# EAGLE schematic PB (EAGLE 9.1.3)
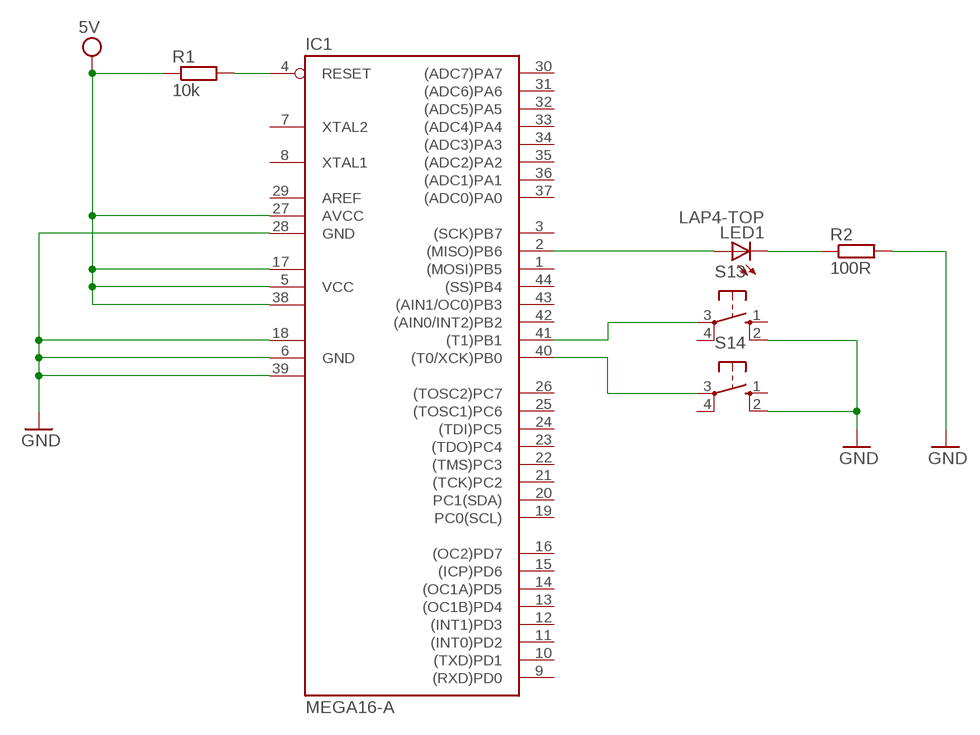
[diagram p0: schematic, sheet 1]

## Parts
IC1  MEGA16-A  [TQFP44]
LED1  LAP4-TOP  [P47F-TOP]
R1  10k  R-EU_M0805  [M0805]
R2  100R  R-EU_M0805  [M0805]
S13  40/XX  [B3F/40XX]
S14  40/XX  [B3F/40XX]

## Nets
GND: IC1.6(GND) IC1.18(GND1) IC1.28(GND) IC1.39(GND2) R2.2 S13.2(S1) S14.2(S1)
N$1: IC1.4(RESET) R1.2
N$5: IC1.41((T1)PB1) S13.3(P)
N$6: IC1.40((T0/XCK)PB0) S14.3(P)
N$7: IC1.2((MISO)PB6) LED1.A
N$8: LED1.C R2.1
VCC: IC1.5(VCC) IC1.17(VCC1) IC1.27(AVCC) IC1.38(VCC2) R1.1 ; supply symbol labelled 5V
Unconnected: IC1.1((MOSI)PB5) IC1.3((SCK)PB7) IC1.7(XTAL2) IC1.8(XTAL1) IC1.9((RXD)PD0) IC1.10((TXD)PD1) IC1.11((INT0)PD2) IC1.12((INT1)PD3) IC1.13((OC1B)PD4) IC1.14((OC1A)PD5) IC1.15((ICP)PD6) IC1.16((OC2)PD7) IC1.19(PC0(SCL)) IC1.20(PC1(SDA)) IC1.21((TCK)PC2) IC1.22((TMS)PC3) IC1.23((TDO)PC4) IC1.24((TDI)PC5) IC1.25((TOSC1)PC6) IC1.26((TOSC2)PC7) IC1.29(AREF) IC1.30((ADC7)PA7) IC1.31((ADC6)PA6) IC1.32((ADC5)PA5) IC1.33((ADC4)PA4) IC1.34((ADC3)PA3) IC1.35((ADC2)PA2) IC1.36((ADC1)PA1) IC1.37((ADC0)PA0) IC1.42((AIN0/INT2)PB2) IC1.43((AIN1/OC0)PB3) IC1.44((SS)PB4) S13.1(S) S13.4(P1) S14.1(S) S14.4(P1)

## Library data of the parts
IC1 = atmel:MEGA16: MICROCONTROLLER 16 Kbytes FLASH 1 kbytes SRAM 512 bytes EEPROM USART 8-channel 10 bit ADC Source: avr.lbr; MPN: ATMEGA16-16AU; OC_FARNELL: 9171134; OC_NEWARK: 96K6515
LED1 = led:*P4: PointLED® Enhanced Thinfilm LED TOP & BOTTOM mount LS P47F, LR P47F, LA P47F, LY P47F, LT P4SG, LB P4SG, LW P4SG Source: http://catalog.osram-os.com .. LA_LR_LS_LY_P47F_Pb_free.pdf
R1 R2 = rcl:R-EU_: RESISTOR, European symbol; SPICEPREFIX: R
S13 S14 = switch-omron:40/XX: OMRON SWITCH; OC_FARNELL: unknown; OC_NEWARK: unknown